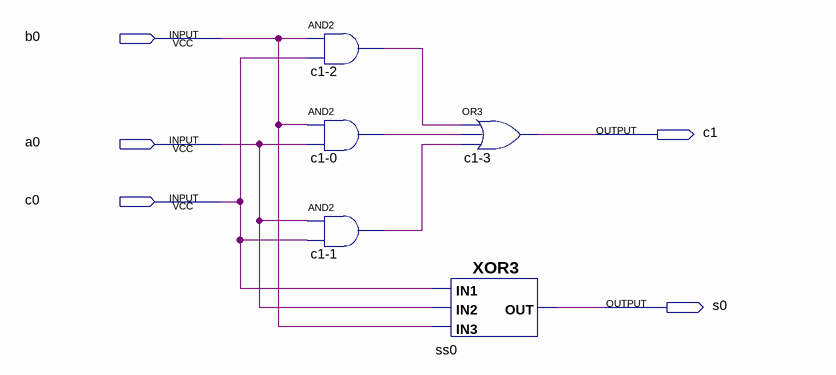
[diagram p0: schematic sheet]
// Quartus schematic Practica2.bdf as structural Verilog: 5 symbols, 5 pins
module Practica2 (
  input  b0,
  input  a0,
  input  c0,
  output c1,
  output s0
);

  wire c1_0_out, c1_1_out, c1_2_out;

  and \c1-2  (c1_2_out, b0, c0);
  and \c1-0  (c1_0_out, b0, a0);
  and \c1-1  (c1_1_out, a0, c0);
  XOR3 ss0 (.IN3(b0), .IN1(c0), .IN2(a0), .OUT(s0));
  or \c1-3  (c1, c1_2_out, c1_0_out, c1_1_out);
endmodule
